# EAGLE design Jacks_EDCPSU (EAGLE 9.5.2)
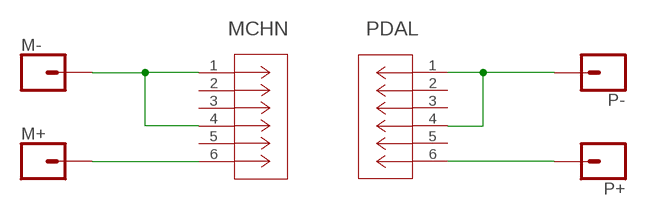
[diagram p0: schematic, sheet 1]

## Parts
M+  CONN_01PTH_NO_SILK_KIT  [1X01NS_KIT]
M-  CONN_01PTH_NO_SILK_KIT  [1X01NS_KIT]
MCHN  ACJS-MHDR  [CONN_MHDR_AMP]
P+  CONN_01PTH_NO_SILK_KIT  [1X01NS_KIT]
P-  CONN_01PTH_NO_SILK_KIT  [1X01NS_KIT]
PDAL  ACJS-MHDR  [CONN_MHDR_AMP]

## Nets
N$1: P-.1 PDAL.1 PDAL.4
N$2: P+.1 PDAL.6
N$3: M-.1 MCHN.1 MCHN.4
N$4: M+.1 MCHN.6
Unconnected: MCHN.2 MCHN.3 MCHN.5 PDAL.2 PDAL.3 PDAL.5

## Library data of the parts
M+ M- P+ P- = SparkFun-Connectors:CONN_01: Single connection point. Often used as Generic Header-pin footprint for 0.1 inch spaced/style header connections On any of the 0.1 inch spaced packages, you can populate with these: Break Away Headers - Straight <https://www.sparkfun.com/products/116> (PRT-00116) Break Away Male Headers - Right Angle <https://www.sparkfun.com/products/553> (PRT-00553) Female Headers <https://www.sparkfun.com/products/115> (PRT-00115) Break Away Headers - Machine Pin <https://www.sparkfun.com/products/117> (PRT-00117) Break Away Female Headers - Swiss Machine Pin <https://www.sparkfun.com/products/743> (PRT-00743) This device is also useful as a general connection point to wire up your design to another part of your project. Our various solder wires solder well into these plated through hole pads. Hook-Up Wire - Assortment (Stranded, 22 AWG) <https://www.sparkfun.com/products/11375> (PRT-11375) Hook-Up Wire - Assortment (Solid Core, 22 AWG) <https://www.sparkfun.com/products/11367> (PRT-11367) View the entire wire category on our website here <https://www.sparkfun.com/categories/141> Special notes: SMTSO-256-ET is a "flush mount" nut for a 4-40 screw. We mostly use this on specialty testbeds; it is a nice way to connect hardware to your PCB at an adjustable hieght. Also note, the SNAP packages are for using a snappable style connector. We sell a baggie of snaps and they are also used on two LilyPad designs: Snap Assortment - 30 pack (male and female) <https://www.sparkfun.com/products/11347> (DEV-11347) LilyPad Arduino SimpleSnap <https://www.sparkfun.com/products/10941> (DEV-10941) LilyPad SimpleSnap Protoboard <https://www.sparkfun.com/products/10940> (DEV-10940)
MCHN PDAL = ACJSMHDR_JACK:ACJS-MHDR; BUILT_BY: EMA_Matt; COPYRIGHT: Copyright (C) 2018 Accelerated Designs. All rights reserved; MANUFACTURER_PART_NUMBER: ACJS-MHDR; SOURCELIBRARY: Amphenol_2019-10-30; VENDOR: Amphenol

## Board
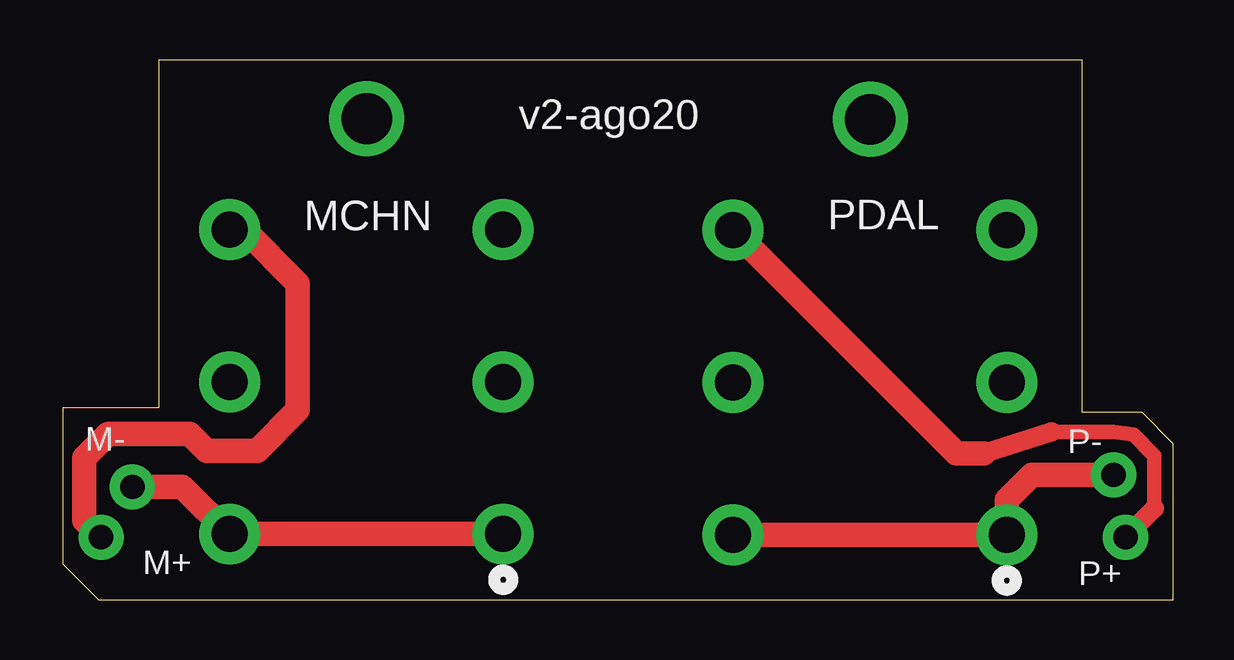
[diagram p1: board, top side]
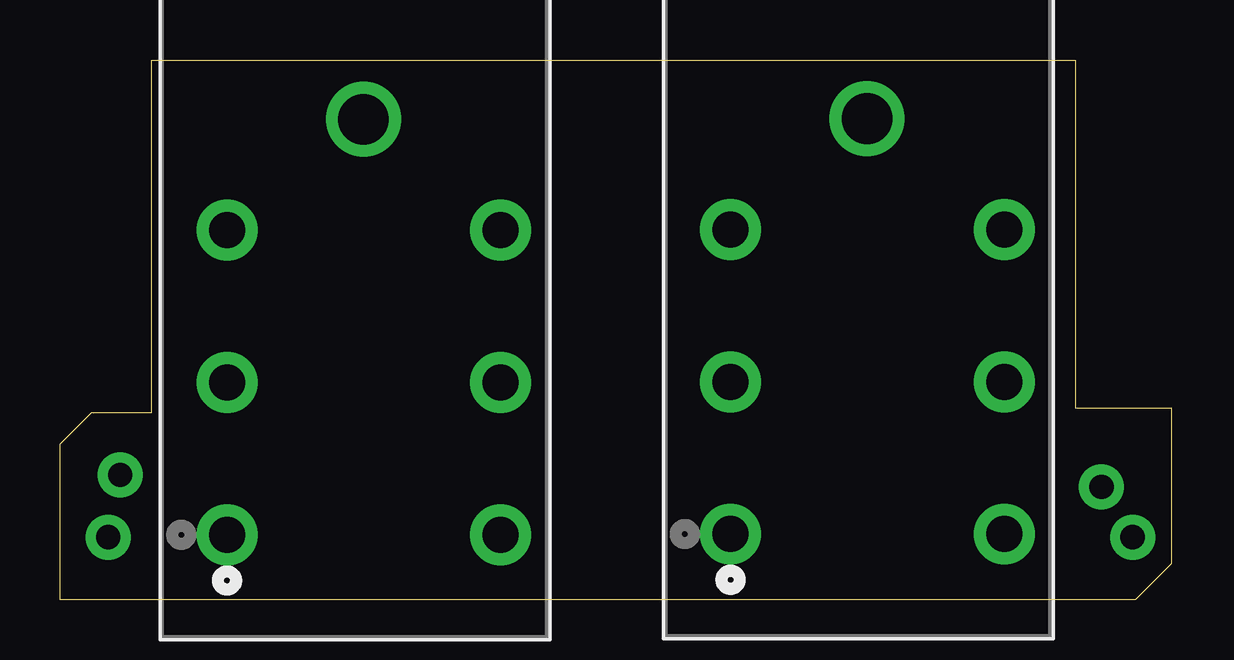
[diagram p2: board, bottom side, seen from below]

Size 46.3 x 22.5 mm. Coordinates in mm from the lower left corner, seen from the top.
Outline: 4,22.5 4,8 0,8 0,1.5 1.5,0 46.3,0 46.3,6.5 45,7.8 42.5,7.8 42.5,22.5 4,22.5
Copper layers (1*16): Top 0.035mm / dielectric 1.5mm / Bottom 0.035mm
Design rules "default *": minimum track width 6mil, minimum drill 0.35mm, track to track 6mil, track to pad 6mil, pad to pad 6mil, via to via 6mil, smd to smd 6mil, copper to edge 12mil, drill to drill 6mil, minimum pad ring 10mil, minimum via ring 8mil, stop-mask expansion 4mil, vias tented up to drill 0mil, thermal gap 10mil

### Footprints (pad centres in the part's own frame; a part is rotated, then mirrored left to right if it is on the bottom)
1X01NS_KIT = drill 1.016 pad 1.88: 1 0,0
CONN_MHDR_AMP = drill 1.5 pad 2.54: 1 0,0; 2 -6.35,0; 3 -12.7,0; 4 0,11.405; 5 -6.35,11.405; 6 -12.7,11.405 | drill 2.108 pad 2.616: 7 -17.323,5.69

### Placement (x,y rotation side)
M+  1.6,2.6 0 bottom
M-  2.9,4.7 0 bottom
MCHN  18.36,2.73 270 bottom
P+  44.3,2.6 0 bottom
P-  43.8,5.2 0 bottom
PDAL  39.35,2.7 270 bottom

### Tracks (layer width: path | path; a pad name or v marks a point on that pad's centre or on a via)
N$1
  Top 1.016: PDAL.4 PDAL.1 39.35,4.15 40.4,5.2 P-.1
N$2
  Top 0.61: 45.5,3.8 45.5,6 44.62,6.88 43.8,7 43.1,7 41.2,7
  Top 0.813: 45.5,3.8 P+.1 | 38.4,6.1 41.2,7
  Top 1.016: PDAL.6 37.24,6.1 38.4,6.1
N$3
  Top 1.016: MCHN.1 MCHN.4 4.98,4.7 M-.1
N$4
  Top 1.016: MCHN.6 7.55,15.43 9.8,13.19 9.8,7.9 8.1,6.2 6,6.2 5.3,6.9 1.9,6.9 0.9,5.9 0.9,3.3 M+.1

### Text on the board
tPlace: v2-ago20